# Altium schematic sheet Circuit_Schematic.SchDoc
size Letter; SheetNumber: 1; SheetTotal: 1
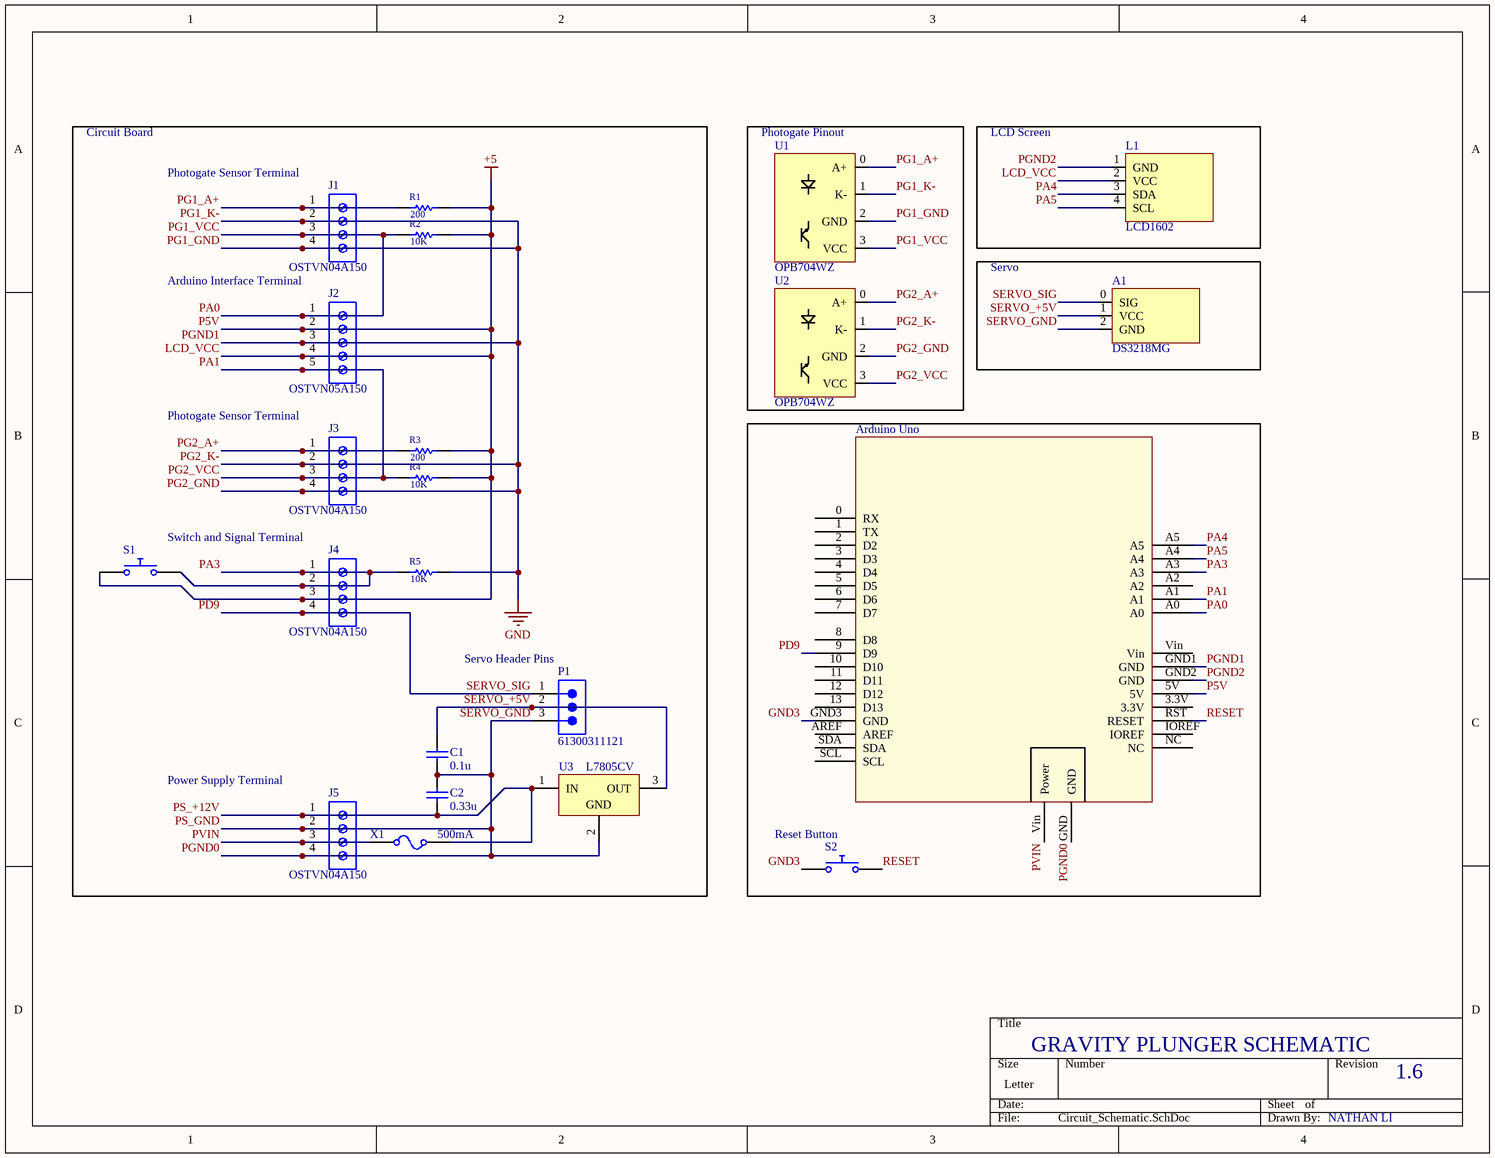
[diagram p0: Circuit_Schematic.SchDoc]

## Parts
A1  DS3218MG
Arduino_Uno  (no value)  [ARDUINO UNO]
C1  value 0.1u  (hidden comment: Capacitor)
C2  value 0.33u  (hidden comment: Capacitor)
J1  OSTVN04A150  [691709710304]
J2  OSTVN05A150  [691127700005B]
J3  OSTVN04A150  [691709710304]
J4  OSTVN04A150  [691709710304]
J5  OSTVN04A150  [691709710304]
L1  LCD1602
P1  61300311121  [61300311121]
R1  value 200  (hidden comment: Resistor)
R2  value 10K  (hidden comment: Resistor)
R3  value 200  (hidden comment: Resistor)
R4  value 10K  (hidden comment: Resistor)
R5  value 10K  (hidden comment: Resistor)
S1  Push Button Normally Opened  (value not drawn)
S2  Push Button Normally Opened  (value not drawn)
U1  OPB704WZ
U2  OPB704WZ
U3  L7805CV  [TO220]
X1  CURRENT: 500mA  (hidden comment: Fuse)

## Blocks framed on the sheet
Photogate Pinout: U1 U2
LCD Screen: L1
Servo: A1
Reset Button: Arduino_Uno S2

## Nets
LCD_VCC: Arduino_Uno.5V J2.2 J2.4 J4.3 L1.2(VCC) R1.2 R2.2 R3.2 R4.2 S1.1  [also labelled +5, P5V]
PG1_GND: Arduino_Uno.GND1(GND) J1.2 J1.4 J2.3 J3.2 J3.4 R5.2 U1.1(K-) U1.2(GND) U2.1(K-) U2.2(GND)  [also labelled GND, PG1_K-, PG2_GND, PG2_K-, PGND1]
GND3: Arduino_Uno.GND3(GND) S2.1
PA0: Arduino_Uno.A0 J1.3 J2.1 R2.1 U1.3(VCC)  [also labelled PG1_VCC]
PA1: Arduino_Uno.A1 J2.5 J3.3 R4.1 U2.3(VCC)  [also labelled PG2_VCC]
PA3: Arduino_Uno.A3 J4.1 J4.2 R5.1 S1.2
PA4: Arduino_Uno.A5 L1.3(SDA)
PA5: Arduino_Uno.A4 L1.4(SCL)
PD9: A1.0(SIG) Arduino_Uno.9(D9) J4.4 P1.1  [also labelled SERVO_SIG]
PG1_A+: J1.1 R1.1 U1.0(A+)
PG2_A+: J3.1 R3.1 U2.0(A+)
PGND0: A1.2(GND) Arduino_Uno.GND C1.2 C2.2 J5.2 J5.4 P1.3 U3.2(GND)  [also labelled PS_GND, SERVO_GND]
PGND2: Arduino_Uno.GND2(GND) L1.1(GND)
PS_+12V: C2.1 J5.1 U3.1(IN) X1.2
PVIN: Arduino_Uno.Vin J5.3 X1.1
RESET: Arduino_Uno.RST(RESET) S2.2
SERVO_+5V: A1.1(VCC) C1.1 P1.2 U3.3(OUT)

Not connected (* = marked no-connect by the designer): Arduino_Uno 0(RX) 1(TX) 2(D2) 3(D3) 3.3V 4(D4) 5(D5) 6(D6) 7(D7) 8(D8) 10(D10) 11(D11) 12(D12) 13(D13) A2 AREF IOREF NC SCL SDA

## Notes on the sheet
- Circuit Board
- (near J1) Photogate Sensor Terminal
- Arduino Interface Terminal
- Photogate Sensor Terminal
- Switch and Signal Terminal
- (near P1) Servo Header Pins
- (near J5) Power Supply Terminal
- GRAVITY PLUNGER SCHEMATIC
- 1.6
- NATHAN LI

## Library data of the parts
A1 = DS3218MG: 270 Degree Servo; ComponentLink1Description: Datasheet; ComponentLink1URL: https://images-na.ssl-images-amazon.com/images/I/81Lbgu+nG6L.pdf; ComponentLink2Description: Supplier Link; ComponentLink2URL: https://www.amazon.com/ANNIMOS-Digital-Waterproof-DS3218MG-Control/dp/B076CNKQX4
Arduino_Uno = ARDUINO UNO
C1 C2 = Capacitor: SimulationGenericComponent: True
J1 J3-J5 = CMP-1502-03337-2: NexarPartId: 34171771; Current: 6A; Voltage: 300V; Number of Positions Per Level: 4; Plating: Steel; Wire Gauge (Max): 30AWG; Pitch: 5mm; Connector Type: Screw; Number of Levels: 1; Color: Black; Lead Pitch: 5mm; Mount: Surface Mount; Flammability Rating: UL94 V-0; Termination: Screw; Housing Material: Nylon; Min Operating Temperature: -40°C; REACH SVHC: Unknown; Number of Pins: 4; Contact Plating: Tin; Packaging: Digi-Reel®; Height: 10.2mm; Number of Rows: 1; Number of Positions: 4; Contact Material: Nickel; Current Rating: 6A; Wire Gauge (Min): 30AWG; Voltage Rating: 300V; Length: 20mm; Wire/Cable Gauge: 30AWG; RoHS: Compliant; Number of Contacts: 4; Max Operating Temperature: 130°C
J2 = CMP-1502-03273-2: NexarPartId: 27602165; Number of Positions Per Level: 5; Wire Gauge (Max): 30AWG; Connector Type: Terminal Block; Voltage Rating: 300V; Pitch: 5.0038mm; Number of Levels: 1; Current: 20A; Stripping Length: 9mm; Wire Gauge (Min): 12AWG; Plating: Steel; RoHS: Compliant; Lead Pitch: 5mm; Packaging: Box; Number of Contacts: 5; Height: 19.5mm; Termination: Screw; Color: Green; Length: 18.6mm; Max Operating Temperature: 105°C; Mount: Through Hole; Wire/Cable Gauge: 30AWG; Number of Pins: 5; Contact Material: Brass; Voltage: 300V; Min Operating Temperature: -40°C; Current Rating: 20A; REACH SVHC: Unknown; Housing Material: Nylon; Contact Plating: Tin; Width: 27.5mm
L1 = LCD 16x2: Liquid I2C LCD 16x2 Display
P1 = CMP-1502-01062-3: NexarPartId: 32855521; Current Rating: 3A; Voltage Rating: 250V; Number of Positions: 3; Pitch: 2.54mm; Contact Resistance: 20mΩ; Connector Type: Male Pin; Gender: Male; REACH SVHC: Unknown; Packaging: Bulk; Contact Material: Copper; Min Operating Temperature: -40°C; Number of Rows: 1; Orientation: Vertical; RoHS: Compliant; Contact Plating: Gold; Max Operating Temperature: 105°C; Mount: Through Hole; Height: 8.94mm; Operating Supply Voltage: 250V; Number of Pins: 3; Contact Mating Length: 5.9944mm; Number of Contacts: 3; Color: Black; Lead Free: Lead Free; Lead Pitch: 2.54mm; Termination: Solder
R1-R5 = Resistor: TC1: 0; SimulationGenericComponent: True; TC2: 0
S1 S2 = Push Button NO: closed: 0; Rclosed: 1m; Ropen: 1Meg; SimulationGenericComponent: True
U3 = CMP-0244-00483-1: Positive Voltage Regulator, 5V, 3-Pin TO-220; PackageDescription: TO, Thru-Hole, Vertical, Heatsink Mounted; 3 In-Line Leads; Pitch 2.54 mm; ComponentLink2Description: Datasheet; PackageReference: TO220; ComponentLink3URL: http://www.st.com/internet/com/TECHNICAL_RESOURCES/TECHNICAL_LITERATURE/PACKAGE_INFORMATION/CD00004649.pdf; DatasheetVersion: 16/11/2011; ComponentLink1Description: Manufacturer URL; ComponentLink1URL: http://www.st.com; PackageVersion: ver3.0; ComponentLink3Description: Package Specification; ComponentLink2URL: http://www.st.com/internet/com/TECHNICAL_RESOURCES/TECHNICAL_LITERATURE/DATASHEET/CD00000444.pdf
X1 = Fuse: RESISTANCE: 1m; SimulationGenericComponent: True